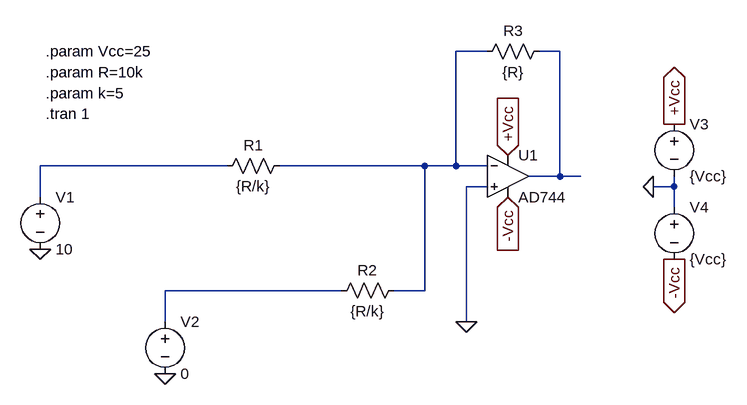
[diagram p0: schematic Draft5.asc]
Draft5.asc, the LTspice schematic file:
Version 4.1
SHEET 1 1204 680
WIRE 736 -80 688 -80
WIRE 848 -80 816 -80
WIRE 336 96 48 96
WIRE 640 96 416 96
WIRE 688 96 688 -80
WIRE 688 96 640 96
WIRE 736 96 688 96
WIRE 848 112 848 -80
WIRE 848 112 800 112
WIRE 880 112 848 112
WIRE 736 128 704 128
WIRE 1024 128 1024 112
WIRE 1024 128 992 128
WIRE 48 144 48 96
WIRE 1024 160 1024 128
WIRE 512 288 240 288
WIRE 640 288 640 96
WIRE 640 288 592 288
WIRE 240 336 240 288
WIRE 704 336 704 128
FLAG 48 224 0
FLAG 240 416 0
FLAG 704 336 0
FLAG 992 128 0
FLAG 1024 32 +Vcc
IOPIN 1024 32 Out
FLAG 1024 240 -Vcc
IOPIN 1024 240 Out
FLAG 768 80 +Vcc
IOPIN 768 80 In
FLAG 768 144 -Vcc
IOPIN 768 144 In
SYMBOL voltage 48 128 R0
SYMATTR InstName V1
SYMATTR Value 10
SYMBOL res 432 80 R90
WINDOW 0 0 56 VBottom 2
WINDOW 3 32 56 VTop 2
SYMATTR InstName R1
SYMATTR Value {R/k}
SYMBOL voltage 240 320 R0
SYMATTR InstName V2
SYMATTR Value 0
SYMBOL res 608 272 R90
WINDOW 0 0 56 VBottom 2
WINDOW 3 32 56 VTop 2
SYMATTR InstName R2
SYMATTR Value {R/k}
SYMBOL OpAmps\\AD744 768 48 R0
SYMATTR InstName U1
SYMBOL res 832 -96 R90
WINDOW 0 0 56 VBottom 2
WINDOW 3 32 56 VTop 2
SYMATTR InstName R3
SYMATTR Value {R}
SYMBOL voltage 1024 16 R0
SYMATTR InstName V3
SYMATTR Value {Vcc}
SYMBOL voltage 1024 144 R0
SYMATTR InstName V4
SYMATTR Value {Vcc}
TEXT 56 -80 Left 2 !.param Vcc=25
TEXT 56 -48 Left 2 !.param R=10k
TEXT 56 -16 Left 2 !.param k=5
TEXT 56 16 Left 2 !.tran 1

The netlist it stands for:
* Draft5.asc
V1 N003 0 10
R1 N001 N003 {R/k}
V2 N004 0 0
R2 N001 N004 {R/k}
X§U1 0 N001 +Vcc -Vcc N002 AD744  ; pins In+ In- V+ V- OUT
R3 N002 N001 {R}
V3 +Vcc 0 {Vcc}
V4 0 -Vcc {Vcc}
.param Vcc=25
.param R=10k
.param k=5
.tran 1
.backanno
.end